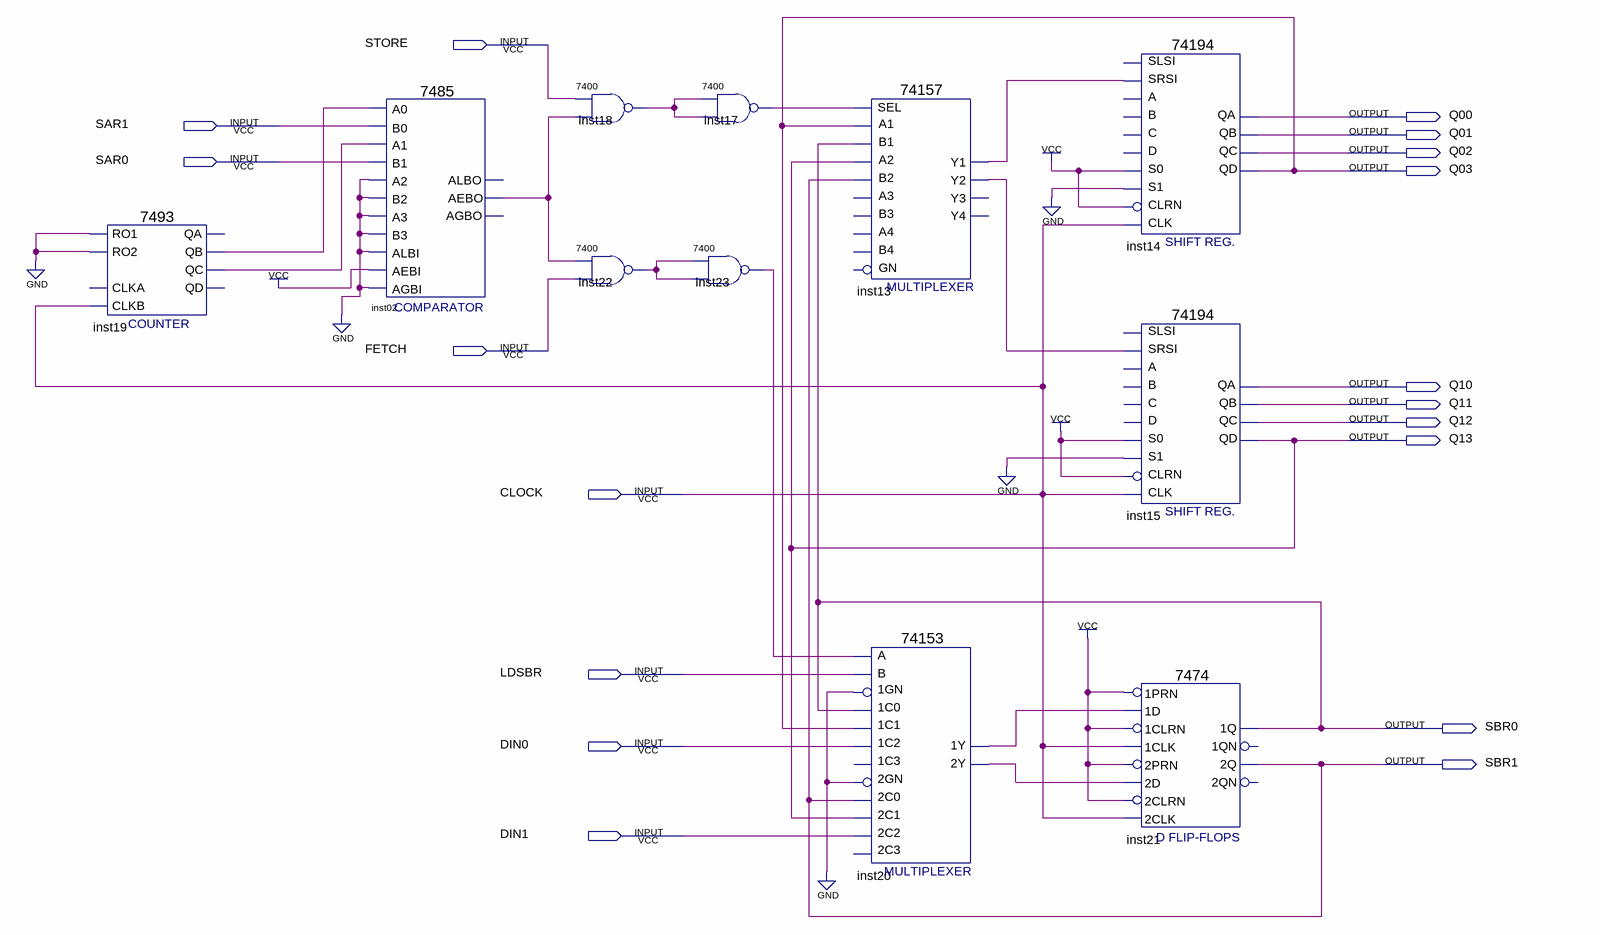
[diagram p0: schematic sheet]
// Quartus schematic Lab2.bdf as structural Verilog: 11 symbols, 18 pins
module Lab2 (
  input  STORE,
  input  SAR1,
  input  SAR0,
  input  FETCH,
  input  CLOCK,
  input  LDSBR,
  input  DIN0,
  input  DIN1,
  output Q00,
  output Q01,
  output Q02,
  output Q03,
  output Q10,
  output Q11,
  output Q12,
  output Q13,
  output SBR0,
  output SBR1
);

  wire inst02_aebo, inst13_y1, inst13_y2, inst17_1, inst18_1, inst19_qb, inst19_qc, inst20_1y, inst20_2y,
       inst22_1, inst23_1;

  \7493  inst19 (.RO1(1'b0), .RO2(1'b0), .CLKB(CLOCK), .QC(inst19_qc), .QB(inst19_qb));  // open: CLKA, QA, QD
  \7485  inst02 (
    .A3(1'b0), .B2(1'b0), .A2(1'b0), .AEBI(1'b1), .AGBI(1'b0), .ALBI(1'b0), .A0(inst19_qb), .B0(SAR1),
    .B3(1'b0), .A1(inst19_qc), .B1(SAR0), .AEBO(inst02_aebo));  // open: ALBO, AGBO
  \7400  inst18 (.\3 (inst02_aebo), .\2 (STORE), .\1 (inst18_1));
  \7400  inst22 (.\3 (FETCH), .\2 (inst02_aebo), .\1 (inst22_1));
  \7400  inst23 (.\3 (inst22_1), .\2 (inst22_1), .\1 (inst23_1));
  \7400  inst17 (.\3 (inst18_1), .\2 (inst18_1), .\1 (inst17_1));
  \74157  inst13 (
    .A1(Q03), .B1(SBR0), .SEL(inst17_1), .B2(SBR1), .A2(Q13), .Y2(inst13_y2), .Y1(inst13_y1));  // open: A3, B3, B4, GN, A4, Y4, Y3
  \74153  inst20 (
    .\1C1 (Q03), .\1GN (1'b0), .\1C0 (SBR0), .\2C0 (SBR1), .\2GN (1'b0), .\2C2 (DIN1), .\1C2 (DIN0),
    .B(LDSBR), .A(inst23_1), .\2C1 (Q13), .\1Y (inst20_1y), .\2Y (inst20_2y));  // open: 1C3, 2C3
  \74194  inst14 (
    .SRSI(inst13_y1), .CLK(CLOCK), .CLRN(1'b1), .S1(1'b0), .S0(1'b1), .QA(Q00), .QB(Q01), .QC(Q02), .QD(Q03));  // open: SLSI, B, C, D, A
  \74194  inst15 (
    .SRSI(inst13_y2), .CLK(CLOCK), .CLRN(1'b1), .S1(1'b0), .S0(1'b1), .QA(Q10), .QB(Q11), .QC(Q12), .QD(Q13));  // open: SLSI, B, C, D, A
  \7474  inst21 (
    .\2D (inst20_2y), .\2PRN (1'b1), .\1CLK (CLOCK), .\1D (inst20_1y), .\1PRN (1'b1), .\2CLK (CLOCK),
    .\2CLRN (1'b1), .\1CLRN (1'b1), .\2Q (SBR1), .\1Q (SBR0));  // open: 1QN, 2QN
endmodule
